# Altium schematic sheet DIFFAMP.SchDoc
size A4; SheetNumber: 2; SheetTotal: 2
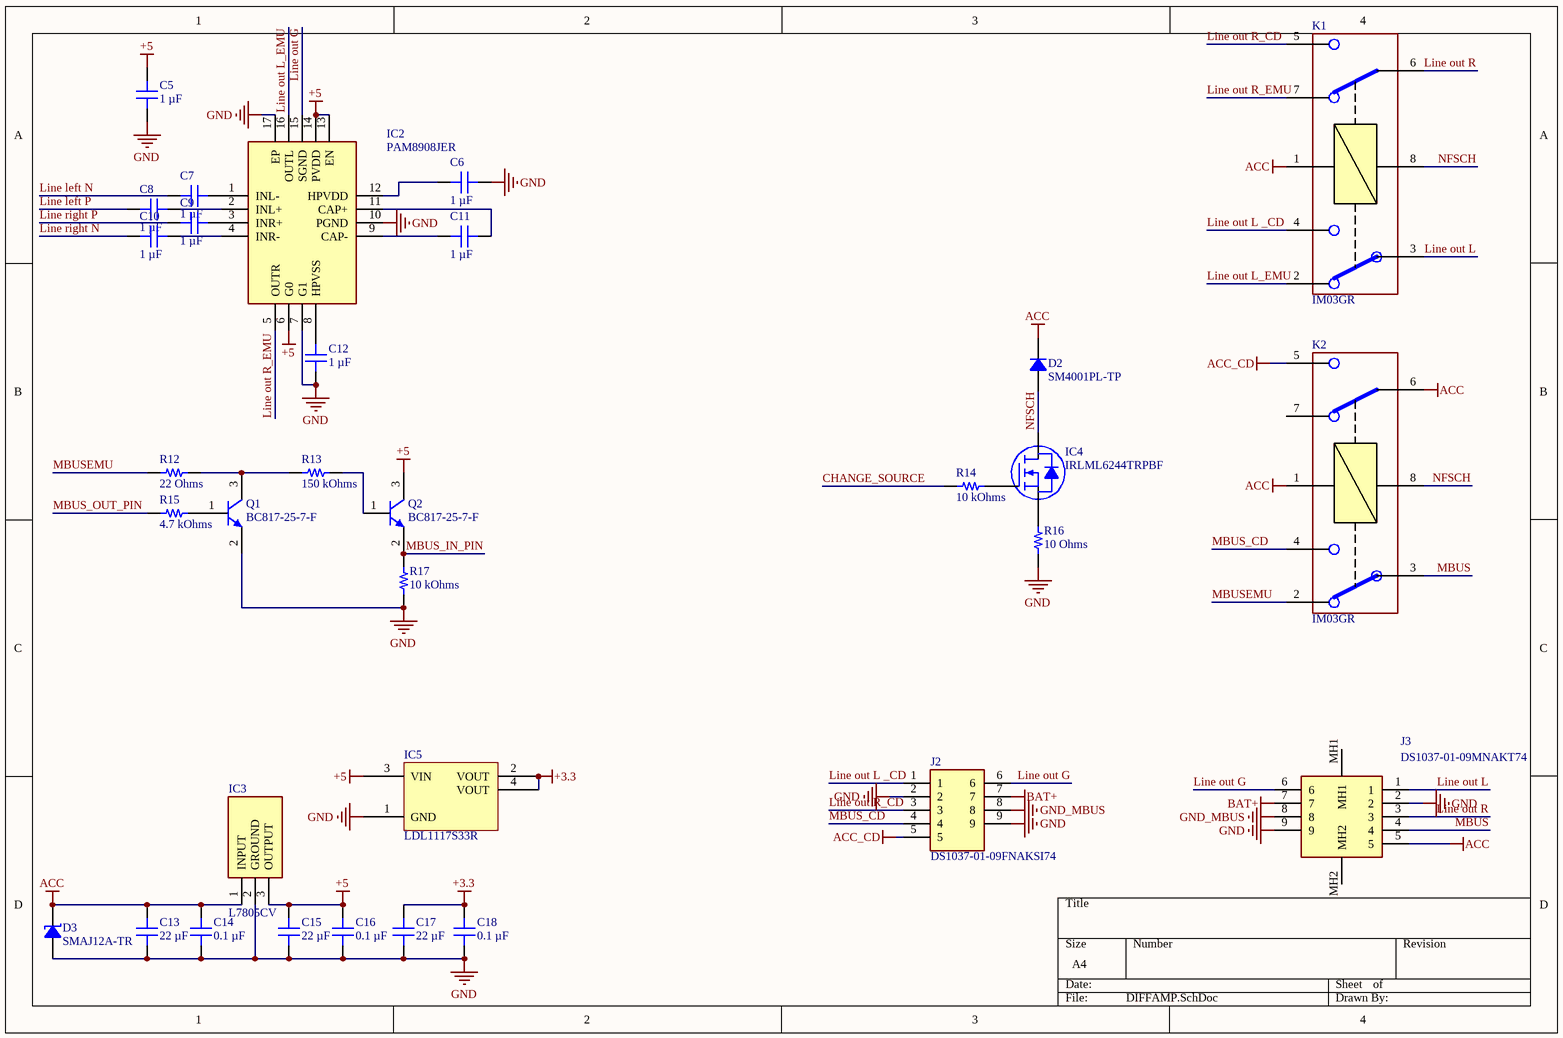
[diagram p0: DIFFAMP.SchDoc]

## Parts
C5  1 µF  [CAP 0603_1608]
C6  1 µF  [CAP 0603_1608]
C7  1 µF  [CAP 0603_1608]
C8  1 µF  [CAP 0603_1608]
C9  1 µF  [CAP 0603_1608]
C10  1 µF  [CAP 0603_1608]
C11  1 µF  [CAP 0603_1608]
C12  1 µF  [CAP 0603_1608]
C13  22 µF  [CAP 1206_3216 - 0.8MM]
C14  0.1 µF  [CAP 0603_1608]
C15  22 µF  [CAP 1206_3216 - 0.8MM]
C16  0.1 µF  [CAP 0603_1608]
C17  22 µF  [CAP 1206_3216 - 0.8MM]
C18  0.1 µF  [CAP 0603_1608]
D2  SM4001PL-TP  [SOD123F]
D3  SMAJ12A-TR  [DO214AC SMA]
IC2  PAM8908JER  [QFN50P300X300X65-17N]
IC3  L7805CV  [TO255P460X1020X2008-3P]
IC4  IRLML6244TRPBF  [INFINEON SOT-23-3]
IC5  LDL1117S33R  [ST SOT-223]
J2  DS1037-01-09FNAKSI74  [DS1037-01-09FNAKSI74]
J3  DS1037-01-09MNAKT74  [DS10370109MNAKT74]
K1  IM03GR  [IM06GR]
K2  IM03GR  [IM06GR]
Q1  BC817-25-7-F  [DIODES SOT-23-3]
Q2  BC817-25-7-F  [DIODES SOT-23-3]
R12  22 Ohms  [YAGEO RES 0603_1608]
R13  150 kOhms  [YAGEO RES 0603_1608]
R14  10 kOhms  [YAGEO RES 0603_1608]
R15  4.7 kOhms  [YAGEO RES 0603_1608]
R16  10 Ohms  [YAGEO RES 0603_1608]
R17  10 kOhms  [YAGEO RES 0603_1608]

## Nets
+3.3: C17.2 C18.2 IC5.2(VOUT) IC5.4(VOUT)
+5: C5.2 C15.2 C16.2 IC2.6(G0) IC2.13(EN) IC2.14(PVDD) IC3.3(OUTPUT) IC5.3(VIN) Q2.3(C)
ACC: C13.2 C14.2 D2.2 D3.2 IC3.1(INPUT) J3.5 K1.1 K2.1 K2.6
ACC_CD: J2.5 K2.5
BAT+: J2.7 J3.7
GND: C5.1 C6.2 C12.1 C13.1 C14.1 C15.1 C16.1 C17.1 C18.1 D3.1 IC2.7(G1) IC2.10(PGND) IC2.17(EP) IC3.2(GROUND) IC5.1(GND) J2.2 J2.9 J3.2 J3.9 Q1.2(E) R16.1 R17.1
GND_MBUS: J2.8 J3.8
CHANGE_SOURCE: R14.1
Line left N: C7.1
Line left P: C8.1
Line out G: IC2.15(SGND) J2.6 J3.6
Line out L: J3.1 K1.3
Line out L _CD: J2.1 K1.4
Line out L_EMU: IC2.16(OUTL) K1.2
Line out R: J3.3 K1.6
Line out R_CD: J2.3 K1.5
Line out R_EMU: IC2.5(OUTR) K1.7
Line right N: C10.1
Line right P: C9.1
MBUS: J3.4 K2.3
MBUS_CD: J2.4 K2.4
MBUS_IN_PIN: Q2.2(E) R17.2
MBUS_OUT_PIN: R15.1
MBUSEMU: K2.2 R12.1
NFSCH: D2.1 IC4.3(D) K1.8 K2.8
NetC6_1: C6.1 IC2.12(HPVDD)
NetC7_2: C7.2 IC2.1(INL-)
NetC8_2: C8.2 IC2.2(INL+)
NetC9_2: C9.2 IC2.3(INR+)
NetC10_2: C10.2 IC2.4(INR-)
NetC11_1: C11.1 IC2.9(CAP-)
NetC11_2: C11.2 IC2.11(CAP+)
NetC12_2: C12.2 IC2.8(HPVSS)
NetIC4_1: IC4.1(G) R14.2
NetIC4_2: IC4.2(S) R16.2
NetQ1_1: Q1.1(B) R15.2
NetQ1_3: Q1.3(C) R12.2 R13.1
NetQ2_1: Q2.1(B) R13.2

Not connected (* = marked no-connect by the designer): J3 MH1 MH2; K2 7

## Library data of the parts
C5-C12 = CC0603KRX5R8BB105: CAP CER 1UF 25V X5R 0603; manufacturer: Yageo; Tolerance: ±10%; Part Number: CC0603KRX5R8BB105; Value: 1 µF; Applications: General Purpose; Capacitance: 1 µF; componentlink1description: Datasheet; componentlink1url: https://www.yageo.com/upload/media/product/productsearch/datasheet/mlcc/UPY-GPHC_X5R_4V-to-50V_25.pdf; componentlink2description: DigiKey Link; componentlink2url: https://www.digikey.com/en/products/detail/yageo/CC0603KRX5R8BB105/2833610; Device Package: 0603 (1608 Metric); lastupdated: 09.02.2024 20:10:27; Lifecycle Status: Active; Minimum Order: 1; Mounting Type: Surface Mount, MLCC; Operating Temperature: -55°C ~ 85°C; Package / Case: 0603 (1608 Metric); packaging: TapeAndReel; partid: 5146; Part Status: Active; price: 0.01; series: CC; Size / Dimension: 0.063" L x 0.031" W (1.60mm x 0.80mm); Supplier 1: DigiKey; Supplier Part Number 1: 311-1445-1-ND; Temperature Coefficient: X5R; Thickness (Max): 0.035" (0.90mm); Voltage - Rated: 25V
C13 C15 C17 = CC1206MKX5R8BB226: CAP CER 22UF 25V X5R 1206; manufacturer: Yageo; Tolerance: ±20%; Part Number: CC1206MKX5R8BB226; Value: 22 µF; Applications: General Purpose; Capacitance: 22 µF; componentlink1description: Datasheet; componentlink1url: https://www.yageo.com/upload/media/product/productsearch/datasheet/mlcc/UPY-GPHC_X5R_4V-to-50V_26.pdf; componentlink2description: DigiKey Link; componentlink2url: https://www.digikey.com/en/products/detail/yageo/CC1206MKX5R8BB226/7164406; Device Package: 1206 (3216 Metric); lastupdated: 04.06.2024 19:10:10; Lifecycle Status: Active; Minimum Order: 1; Mounting Type: Surface Mount, MLCC; Operating Temperature: -55°C ~ 85°C; Package / Case: 1206 (3216 Metric); packaging: TapeAndReel; partid: 45374; Part Status: Active; price: 0.13; series: CC; Size / Dimension: 0.126" L x 0.063" W (3.20mm x 1.60mm); Supplier 1: DigiKey; Supplier Part Number 1: 311-3522-1-ND; Temperature Coefficient: X5R; Thickness (Max): 0.075" (1.90mm); Voltage - Rated: 25V
C14 C16 C18 = CC0603KRX7R7BB104: CAP CER 0.1UF 16V X7R 0603; manufacturer: Yageo; Tolerance: ±10%; Part Number: CC0603KRX7R7BB104; Value: 0.1 µF; Applications: General Purpose; Capacitance: 0.1 µF; componentlink1description: Datasheet; componentlink1url: https://www.yageo.com/upload/media/product/productsearch/datasheet/mlcc/UPY-GPHC_X7R_6.3V-to-50V_18.pdf; componentlink2description: DigiKey Link; componentlink2url: https://www.digikey.com/en/products/detail/yageo/CC0603KRX7R7BB104/302822; Device Package: 0603 (1608 Metric); lastupdated: 09.02.2024 20:10:09; Lifecycle Status: Active; Minimum Order: 1; Mounting Type: Surface Mount, MLCC; Operating Temperature: -55°C ~ 125°C; Package / Case: 0603 (1608 Metric); packaging: TapeAndReel; partid: 16746; Part Status: Active; price: 0.01; series: CC; Size / Dimension: 0.063" L x 0.031" W (1.60mm x 0.80mm); Supplier 1: DigiKey; Supplier Part Number 1: 311-1088-1-ND; Temperature Coefficient: X7R; Thickness (Max): 0.035" (0.90mm); Voltage - Rated: 16V
D2 = SM4001PL-TP: DIODE GEN PURP 50V 1A SOD123FL; Manufacturer: Micro Commercial Co; Capacitance @ Vr, F: 15pF @ 4V, 1MHz; Current - Reverse Leakage @ Vr: 5 µA @ 50 V; Diode Type: Standard; Speed: Standard Recovery >500ns, > 200mA (Io); Voltage - Forward (Vf) (Max) @ If: 1.1 V @ 1 A; Part Number: SM4001PL-TP; ComponentLink1Description: Datasheet; ComponentLink1URL: https://www.mccsemi.com/pdf/Products/SM4001PL-SM4007PL(SOD-123FL).PDF; ComponentLink2Description: DigiKey Link; ComponentLink2URL: https://www.digikey.com/en/products/detail/micro-commercial-co/SM4001PL-TP/1793244; Current - Average Rectified (Io): 1A; LastUpdated: 15.07.2023 19:37:24; Lifecycle Status: Active; Minimum Order: 1; Mounting Type: Surface Mount; Operating Temperature - Junction: -65°C ~ 175°C; Package / Case: SOD-123F; Packaging: TapeAndReel; PartId: 1093; Part Status: Active; Price: 0.03; Series: -; Supplier 1: DigiKey; Supplier Part Number 1: SM4001PL-TPMSCT-ND; Supplier Device Package: SOD-123FL; Voltage - DC Reverse (Vr) (Max): 50 V
D3 = SMAJ12A-TR: TVS DIODE 12VWM 25.3VC SMA; Manufacturer: STMicroelectronics; Current - Peak Pulse (10/1000µs): 91A (8/20µs); Power Line Protection: No; Power - Peak Pulse: 400W; Type: Zener; Unidirectional Channels: 1; Voltage - Breakdown (Min): 13.3V; Voltage - Clamping (Max) @ Ipp: 25.3V; Voltage - Reverse Standoff (Typ): 12V; Part Number: SMAJ12A-TR; Applications: General Purpose; ComponentLink1Description: Datasheet; ComponentLink1URL: http://www.st.com/content/ccc/resource/technical/document/datasheet/ff/c0/80/cc/19/4c/45/af/CD00001333.pdf/files/CD00001333.pdf/_jcr_content/translations/en.CD00001333.pdf; ComponentLink2Description: DigiKey Link; ComponentLink2URL: https://www.digikey.com/en/products/detail/stmicroelectronics/SMAJ12A-TR/1039101; LastUpdated: 03.06.2024 19:57:26; Lifecycle Status: Active; Minimum Order: 1; Mounting Type: Surface Mount; Operating Temperature: -55°C ~ 150°C (TJ); Package / Case: DO-214AC, SMA; Packaging: TapeAndReel; PartId: 6160; Part Status: Active; Price: 0.09; Series: SMAJ, TRANSIL™; Supplier 1: DigiKey; Supplier Part Number 1: 497-6503-1-ND; Supplier Device Package: DO-214AC (SMA)
IC2 = PAM8908JER: Integrated Circuit; Manufacturer_Name: Diodes Incorporated; Datasheet Link: https://www.diodes.com//assets/Datasheets/PAM8908.pdf; Height: 0.65mm; Manufacturer_Part_Number: PAM8908JER; Mouser Part Number: 621-PAM8908JER; Mouser Price/Stock: https://www.mouser.co.uk/ProductDetail/Diodes-Incorporated/PAM8908JER?qs=%252BSlWJf1dfkITtmNpMlm%252Bnw%3D%3D; Arrow Part Number: PAM8908JER; Arrow Price/Stock: https://www.arrow.com/en/products/pam8908jer/diodes-incorporated?region=asia
IC3 = L7805CV: Integrated Circuit; Manufacturer_Name: STMicroelectronics; Datasheet Link: http://www.st.com/web/en/resource/technical/document/datasheet/CD00000444.pdf; Height: 4.6mm; Manufacturer_Part_Number: L7805CV; Mouser Part Number: 511-L7805CV; Mouser Price/Stock: https://www.mouser.co.uk/ProductDetail/STMicroelectronics/L7805CV?qs=9NrABl3fj%2FqplZAHiYUxWg%3D%3D; Arrow Part Number: L7805CV; Arrow Price/Stock: https://www.arrow.com/en/products/l7805cv/stmicroelectronics?region=europe
IC4 = IRLML6244TRPBF: MOSFET N-CH 20V 6.3A SOT23; Manufacturer: Infineon Technologies; Current - Continuous Drain (Id) @ 25°C: 6.3A (Ta); Drive Voltage (Max Rds On,  Min Rds On): 2.5V, 4.5V; FET Type: N-Channel; Gate Charge (Qg) (Max) @ Vgs: 8.9 nC @ 4.5 V; Input Capacitance (Ciss) (Max) @ Vds: 700 pF @ 16 V; Power Dissipation (Max): 1.3W (Ta); Rds On (Max) @ Id, Vgs: 21mOhm @ 6.3A, 4.5V; Vgs (Max): ±12V; Vgs(th) (Max) @ Id: 1.1V @ 10µA; Part Number: IRLML6244TRPBF; ComponentLink1Description: Datasheet; ComponentLink1URL: https://www.infineon.com/dgdl/irlml6244pbf.pdf?fileId=5546d462533600a4015356686fed261f; ComponentLink2Description: DigiKey Link; ComponentLink2URL: https://www.digikey.com/en/products/detail/infineon-technologies/IRLML6244TRPBF/2393871; Drain to Source Voltage (Vdss): 20 V; LastUpdated: 03.06.2024 20:15:22; Lifecycle Status: Active; Minimum Order: 1; Mounting Type: Surface Mount; Operating Temperature: -55°C ~ 150°C (TJ); Package / Case: TO-236-3, SC-59, SOT-23-3; Packaging: TapeAndReel; Part Status: Active; Price: 0.09; Series: HEXFET®; Supplier 1: DigiKey; Supplier Part Number 1: IRLML6244TRPBFCT-ND; Supplier Device Package: Micro3™/SOT-23; Technology: MOSFET (Metal Oxide)
IC5 = LDL1117S33R: IC REG LINEAR 3.3V 1.2A SOT223; Manufacturer: STMicroelectronics; Current - Quiescent (Iq): 500 µA; Number of Regulators: 1; Output Configuration: Positive; Output Type: Fixed; Protection Features: Over Current, Over Temperature, Under Voltage Lockout (UVLO); PSRR: 87dB ~ 65dB (120Hz ~ 100kHz); Voltage Dropout (Max): 0.6V @ 1.2A; Voltage - Input (Max): 18V; Part Number: LDL1117S33R; ComponentLink1Description: Datasheet; ComponentLink1URL: http://www.st.com/content/ccc/resource/technical/document/datasheet/group3/0e/5a/00/ca/10/1a/4f/a5/DM00366442/files/DM00366442.pdf/jcr:content/translations/en.DM00366442.pdf; ComponentLink2Description: DigiKey Link; ComponentLink2URL: https://www.digikey.com/en/products/detail/stmicroelectronics/LDL1117S33R/7102071; Current - Output: 1.2A; LastUpdated: 03.06.2024 20:25:59; Lifecycle Status: Active; Minimum Order: 1; Mounting Type: Surface Mount; Operating Temperature: -40°C ~ 125°C (TJ); Package / Case: TO-261-4, TO-261AA; Packaging: TapeAndReel; Part Status: Active; Price: 0.31; Series: -; Supplier 1: DigiKey; Supplier Part Number 1: 497-17239-1-ND; Supplier Device Package: SOT-223; Voltage - Output (Min/Fixed): 3.3V
J2 = DS1037-01-09FNAKSI74: Connector; Manufacturer_Name: Connfly; Manufacturer_Part_Number: DS1037-01-09FNAKSI74
J3 = DS1037-01-09MNAKT74: Connector; Manufacturer_Name: Connfly; Datasheet Link: http://en.connfly.group/static/upload/file/pdf/DS1037-01.pdf; Height: 12.88mm; Manufacturer_Part_Number: DS1037-01-09MNAKT74
K1 K2 = IM03GR: Relay or Contactor; Manufacturer_Name: TE Connectivity; Datasheet Link: https://datasheet.datasheetarchive.com/originals/distributors/Datasheets_SAMA/af0478e68580ade93768a4593bd7be66.pdf; Manufacturer_Part_Number: IM03GR; Mouser Part Number: 655-IM03GR; Mouser Price/Stock: https://www.mouser.co.uk/ProductDetail/TE-Connectivity/IM03GR?qs=h8jywBNgiq20bLq7q22y%252Bg%3D%3D; Arrow Part Number: IM03GR; Arrow Price/Stock: https://www.arrow.com/en/products/im03gr/te-connectivity?region=nac
Q1 Q2 = BC817-25-7-F: TRANS NPN 45V 0.5A SOT23-3; Manufacturer: Diodes Incorporated; Current - Collector Cutoff (Max): 100nA; Current - Collector (Ic) (Max): 500 mA; DC Current Gain (hFE) (Min) @ Ic, Vce: 160 @ 100mA, 1V; Frequency - Transition: 100MHz; Power - Max: 310 mW; Vce Saturation (Max) @ Ib, Ic: 700mV @ 50mA, 500mA; Part Number: BC817-25-7-F; ComponentLink1Description: Datasheet; ComponentLink1URL: https://www.diodes.com/assets/Datasheets/ds11107.pdf; ComponentLink2Description: DigiKey Link; ComponentLink2URL: https://www.digikey.com/en/products/detail/diodes-incorporated/BC817-25-7-F/768871; LastUpdated: 03.06.2024 20:24:11; Lifecycle Status: Active; Minimum Order: 1; Mounting Type: Surface Mount; Operating Temperature: -65°C ~ 150°C (TJ); Package / Case: TO-236-3, SC-59, SOT-23-3; Packaging: TapeAndReel; PartId: 114; Part Status: Active; Price: 0.02; Series: -; Supplier 1: DigiKey; Supplier Part Number 1: BC817-25FDICT-ND; Supplier Device Package: SOT-23-3; Transistor Type: NPN; Voltage - Collector Emitter Breakdown (Max): 45 V
R12 = RC0603JR-0722RL: RES 22 OHM 5% 1/10W 0603; Manufacturer: Yageo; Power (Watts): 0.1W, 1/10W; Temperature Coefficient: ±100ppm/°C; Part Number: RC0603JR-0722RL; Value: 22 Ohms; ComponentLink1Description: Datasheet; ComponentLink1URL: https://www.yageo.com/upload/media/product/productsearch/datasheet/rchip/PYu-RC_Group_51_RoHS_L_10.pdf; ComponentLink2Description: DigiKey Link; ComponentLink2URL: https://www.digikey.com/en/products/detail/yageo/RC0603JR-0722RL/726743; Composition: Thick Film; Device Package: 0603 (1608 Metric); Features: Moisture Resistant; Height - Seated (Max): 0.022" (0.55mm); LastUpdated: 25.07.2024 9:19:24; Lifecycle Status: Active; Minimum Order: 1; Number of Terminations: 2; Operating Temperature: -55°C ~ 155°C; Package / Case: 0603 (1608 Metric); Packaging: CutTape; PartId: 17085; Part Status: Active; Price: 0.01; Resistance: 22 Ohms; Series: RC_L; Size / Dimension: 0.063" L x 0.031" W (1.60mm x 0.80mm); Supplier 1: DigiKey; Supplier Part Number 1: 311-22GRCT-ND; Supplier Device Package: 0603; Tolerance: ±5%
R13 = RC0603FR-07150KL: RES 150K OHM 1% 1/10W 0603; Manufacturer: Yageo; Power (Watts): 0.1W, 1/10W; Temperature Coefficient: ±100ppm/°C; Part Number: RC0603FR-07150KL; Value: 150 kOhms; ComponentLink1Description: Datasheet; ComponentLink1URL: https://www.yageo.com/upload/media/product/productsearch/datasheet/rchip/PYu-RC_Group_51_RoHS_L_10.pdf; ComponentLink2Description: DigiKey Link; ComponentLink2URL: https://www.digikey.com/en/products/detail/yageo/RC0603FR-07150KL/726959; Composition: Thick Film; Device Package: 0603 (1608 Metric); Features: Moisture Resistant; Height - Seated (Max): 0.022" (0.55mm); LastUpdated: 25.07.2024 9:19:21; Lifecycle Status: Active; Minimum Order: 1; Number of Terminations: 2; Operating Temperature: -55°C ~ 155°C; Package / Case: 0603 (1608 Metric); Packaging: CutTape; PartId: 18953; Part Status: Active; Price: 0.01; Resistance: 150 kOhms; Series: RC_L; Size / Dimension: 0.063" L x 0.031" W (1.60mm x 0.80mm); Supplier 1: DigiKey; Supplier Part Number 1: 311-150KHRCT-ND; Supplier Device Package: 0603; Tolerance: ±1%
R14 R17 = RC0603FR-1310KL: RES 10K OHM 1% 1/10W 0603; Manufacturer: Yageo; Power (Watts): 0.1W, 1/10W; Temperature Coefficient: ±100ppm/°C; Part Number: RC0603FR-1310KL; Value: 10 kOhms; ComponentLink1Description: Datasheet; ComponentLink1URL: https://www.yageo.com/upload/media/product/productsearch/datasheet/rchip/PYu-RC_Group_51_RoHS_L_11.pdf; ComponentLink2Description: DigiKey Link; ComponentLink2URL: https://www.digikey.com/en/products/detail/yageo/RC0603FR-1310KL/12756399; Composition: Thick Film; Device Package: 0603 (1608 Metric); Features: Moisture Resistant; Height - Seated (Max): 0.022" (0.55mm); LastUpdated: 25.07.2024 9:19:08; Lifecycle Status: Active; Minimum Order: 1; Number of Terminations: 2; Operating Temperature: -55°C ~ 155°C; Package / Case: 0603 (1608 Metric); Packaging: CutTape; PartId: 67561; Part Status: Active; Price: 0.01; Resistance: 10 kOhms; Series: RC_L; Size / Dimension: 0.063" L x 0.031" W (1.60mm x 0.80mm); Supplier 1: DigiKey; Supplier Part Number 1: 13-RC0603FR-1310KLCT-ND; Supplier Device Package: 0603; Tolerance: ±1%
R15 = RC0603FR-074K7L: RES 4.7K OHM 1% 1/10W 0603; Manufacturer: Yageo; Power (Watts): 0.1W, 1/10W; Temperature Coefficient: ±100ppm/°C; Part Number: RC0603FR-074K7L; Value: 4.7 kOhms; ComponentLink1Description: Datasheet; ComponentLink1URL: https://www.yageo.com/upload/media/product/productsearch/datasheet/rchip/PYu-RC_Group_51_RoHS_L_10.pdf; ComponentLink2Description: DigiKey Link; ComponentLink2URL: https://www.digikey.com/en/products/detail/yageo/RC0603FR-074K7L/727212; Composition: Thick Film; Device Package: 0603 (1608 Metric); Features: Moisture Resistant; Height - Seated (Max): 0.022" (0.55mm); LastUpdated: 25.07.2024 9:19:17; Lifecycle Status: Active; Minimum Order: 1; Number of Terminations: 2; Operating Temperature: -55°C ~ 155°C; Package / Case: 0603 (1608 Metric); Packaging: CutTape; PartId: 23949; Part Status: Active; Price: 0.01; Resistance: 4.7 kOhms; Series: RC_L; Size / Dimension: 0.063" L x 0.031" W (1.60mm x 0.80mm); Supplier 1: DigiKey; Supplier Part Number 1: 311-4.70KHRCT-ND; Supplier Device Package: 0603; Tolerance: ±1%
R16 = RC0603FR-0710RL: RES 10 OHM 1% 1/10W 0603; Manufacturer: Yageo; Power (Watts): 0.1W, 1/10W; Temperature Coefficient: ±200ppm/°C; Part Number: RC0603FR-0710RL; Value: 10 Ohms; ComponentLink1Description: Datasheet; ComponentLink1URL: https://www.yageo.com/upload/media/product/productsearch/datasheet/rchip/PYu-RC_Group_51_RoHS_L_10.pdf; ComponentLink2Description: DigiKey Link; ComponentLink2URL: https://www.digikey.com/en/products/detail/yageo/RC0603FR-0710RL/726879; Composition: Thick Film; Device Package: 0603 (1608 Metric); Features: Moisture Resistant; Height - Seated (Max): 0.022" (0.55mm); LastUpdated: 25.07.2024 9:19:19; Lifecycle Status: Active; Minimum Order: 1; Number of Terminations: 2; Operating Temperature: -55°C ~ 155°C; Package / Case: 0603 (1608 Metric); Packaging: TapeAndReel; PartId: 22607; Part Status: Active; Price: 0.01; Resistance: 10 Ohms; Series: RC_L; Size / Dimension: 0.063" L x 0.031" W (1.60mm x 0.80mm); Supplier 1: DigiKey; Supplier Part Number 1: 311-10.0HRCT-ND; Supplier Device Package: 0603; Tolerance: ±1%